# Altium schematic sheet PAGE115.SchDoc
size 246 x 182 mm
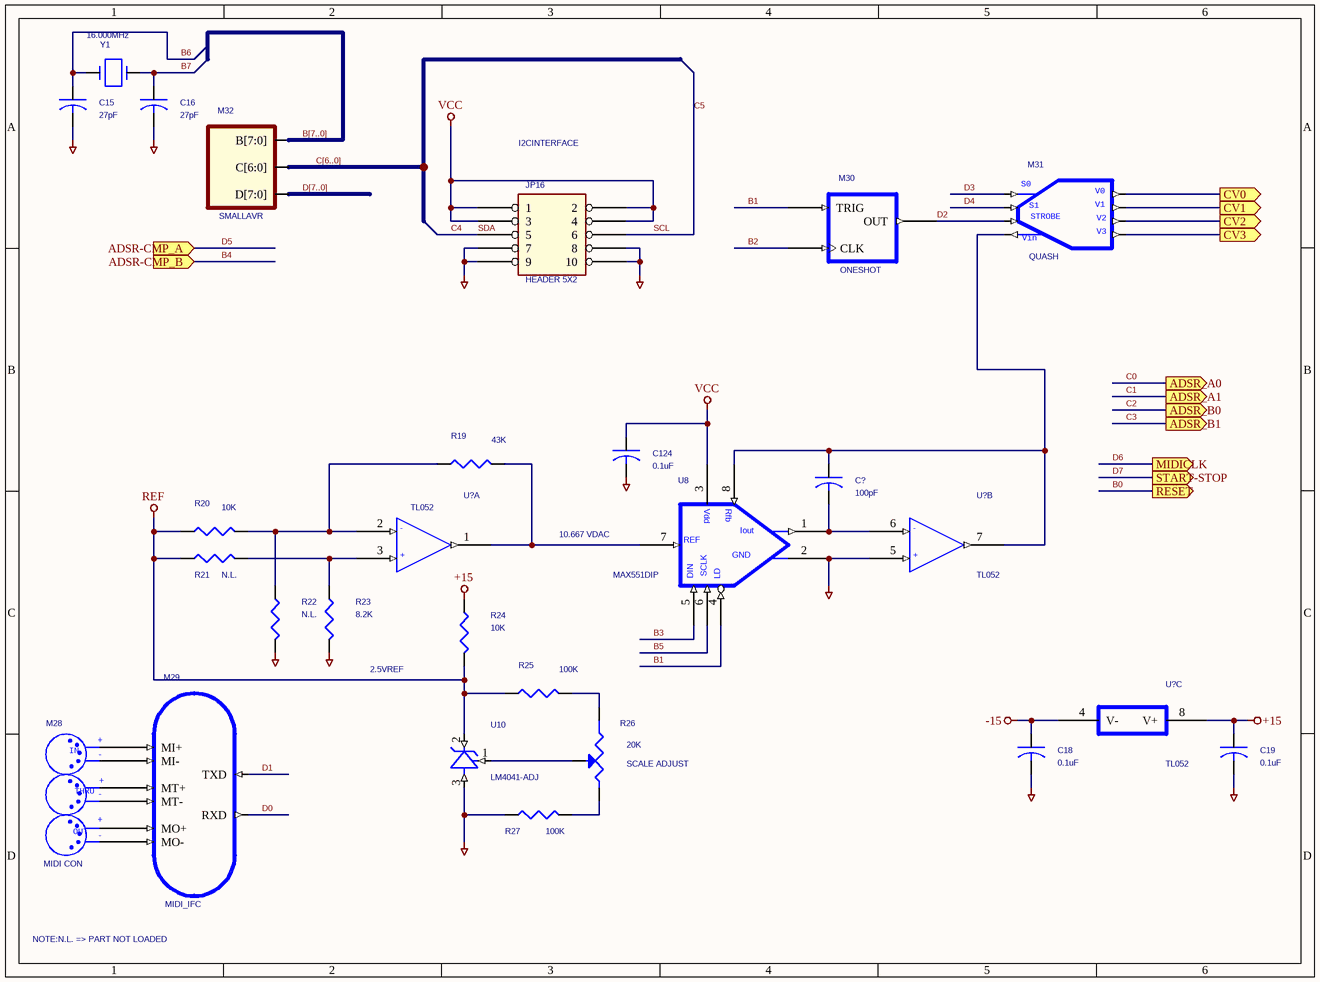
[diagram p0: PAGE115.SchDoc]

## Parts
(Parts that share a designator on the sheet are numbered #1, #2 ... from top to bottom, then left to right.)
C15  27pF  [RAD0.1]
C16  27pF  [RAD0.1]
C18  0.1uF  [AXIALCAP0.3]
C19  0.1uF  [AXIALCAP0.3]
C124  0.1uF  [AXIALCAP0.3]
C?  100pF  [RAD0.1]
JP16  HEADER 5X2  [IDC10-AMP]
M28  MIDI CON
M29  MIDI_IFC
M30  ONESHOT
M31  QUASH
M32  SMALLAVR
R19  43K  [AXIAL0.4]
R20  10K  [AXIAL0.4]
R21  N.L.  [AXIAL0.4]
R22  N.L.  [AXIAL0.4]
R23  8.2K  [AXIAL0.4]
R24  10K  [AXIAL0.4]
R25  100K  [AXIAL0.4]
R26  20K  [TRIMPOT-3006]
R27  100K  [AXIAL0.4]
U8  MAX551DIP  [DIP8]
U10  LM4041-ADJ  [TO92-LM336]
U?#1  TL052  [DIP8]  (part A of 3)
U?#2  TL052  [DIP8]  (part B of 3)
U?#3  TL052  [DIP8]  (part C of 3)
Y1  16.000MHz  [XTAL]

## Ports
ADSR-CMP_A (in), ADSR-CMP_B (in), ADSR_A0 (out), ADSR_A1 (out), ADSR_B0 (out), ADSR_B1 (out), CV0 (out), CV1 (out), CV2 (out), CV3 (out), MIDICLK (out), RESET (out), START-STOP (out)

## Nets
+15: C19.1 R24.1 U?#3.8(V+)
-15: C18.1 U?#3.4(V-)
AGND: C15.2 C16.2 C18.2 C19.2 C124.2 JP16.7 JP16.8 JP16.9 JP16.10 R22.2 R23.2 R27.1 U8.2(GND) U10.3(ANODE) U?#2.5(+)
REF: R20.1 R21.1 R24.2 R25.1 U10.2(CATHODE)
VCC: C124.1 JP16.1 JP16.2 JP16.3 JP16.4 U8.3(VDD)
B0: port RESET
B1: M30.TRIG U8.4(LD)
B2: M30.CLK
B3: U8.5(DIN)
B4: port ADSR-CMP_B
B5: U8.6(SCLK)
B6: C15.1 Y1.2
B7: C16.1 Y1.1
C0: port ADSR_A0
C1: port ADSR_A1
C2: port ADSR_B0
C3: port ADSR_B1
C4: JP16.5  [also labelled SDA]
C5: JP16.6  [also labelled SCL]
CV0: M31.VO0 ; port CV0
CV1: M31.VO1 ; port CV1
CV2: M31.VO2 ; port CV2
CV3: M31.VO3 ; port CV3
D0: M29.RXD
D1: M29.TXD
D2: M30.OUT M31.STROBE
D3: M31.S0
D4: M31.S1
D5: port ADSR-CMP_A
D6: port MIDICLK
D7: port START-STOP
NetC?_1: C?.1 M31.VIN U8.8(Rfb) U?#2.7(OUT)
NetC?_2: C?.2 U8.1(Iout) U?#2.6(-)
NetM28_MI+: M28.MI+ M29.MI+
NetM28_MI-: M28.MI- M29.MI-
NetM28_MO+: M28.MO+ M29.MO+
NetM28_MO-: M28.MO- M29.MO-
NetM28_MT+: M28.MT+ M29.MT+
NetM28_MT-: M28.MT- M29.MT-
NetR19_1: R19.1 R20.2 R22.1 U?#1.2(-)
NetR19_2: R19.2 U8.7(VREF) U?#1.1(OUT)
NetR21_2: R21.2 R23.1 U?#1.3(+)
NetR25_2: R25.2 R26.B
NetR26_A: R26.A R27.2
NetR26_WIPER: R26.WIPER U10.1(ADJ)

Not connected (* = marked no-connect by the designer): M32 B[7:0] C[6:0] D[7:0]

## Buses and harness runs
bus B[7..0]
bus C[6..0]
bus D[7..0]

## Notes on the sheet
- I2CINTERFACE
- 10.667 VDAC
- 2.5VREF
- (near R26) SCALE ADJUST
- NOTE:N.L. => PART NOT LOADED
- (in symbol MAX551DIP) Vdd; REF
- (in symbol MIDI CON) +; IN; -; THRU; OUT
- (in symbol QUASH) V0; V1; V2; V3; Vin

## Library data of the parts
C15 C16 C18 C19 C124 C? = CAP_Dup1
R19-R25 R27 = R_Dup1
R26 = POT
U?#1-U?#3 = GEN DUAL OPAMP-H: PACKAGE: MIDI2CV
Y1 = CRYSTAL
M28 = MIDI CON: TitleBlock_1_Page_Number: =M28_TitleBlock_1_Page_Number; TitleBlock_1_Title: =M28_TitleBlock_1_Title
M29 = MIDI_IFC: TitleBlock_4_Page_Number: =M29_TitleBlock_4_Page_Number
M31 = QUASH: C__13_PartReference: =M31_C__13_PartReference; M34_C__21_PartReference: =M31_M34_C__21_PartReference; M34_TitleBlock_1_Page_Number: =M31_M34_TitleBlock_1_Page_Number; M34_TitleBlock_1_Title: =M31_M34_TitleBlock_1_Title; C__14_PartReference: =M31_C__14_PartReference